# EAGLE design 4channelWormbotShield_fixed_PCBv03_addSSRresist_wThermalRel (EAGLE 9.6.2)
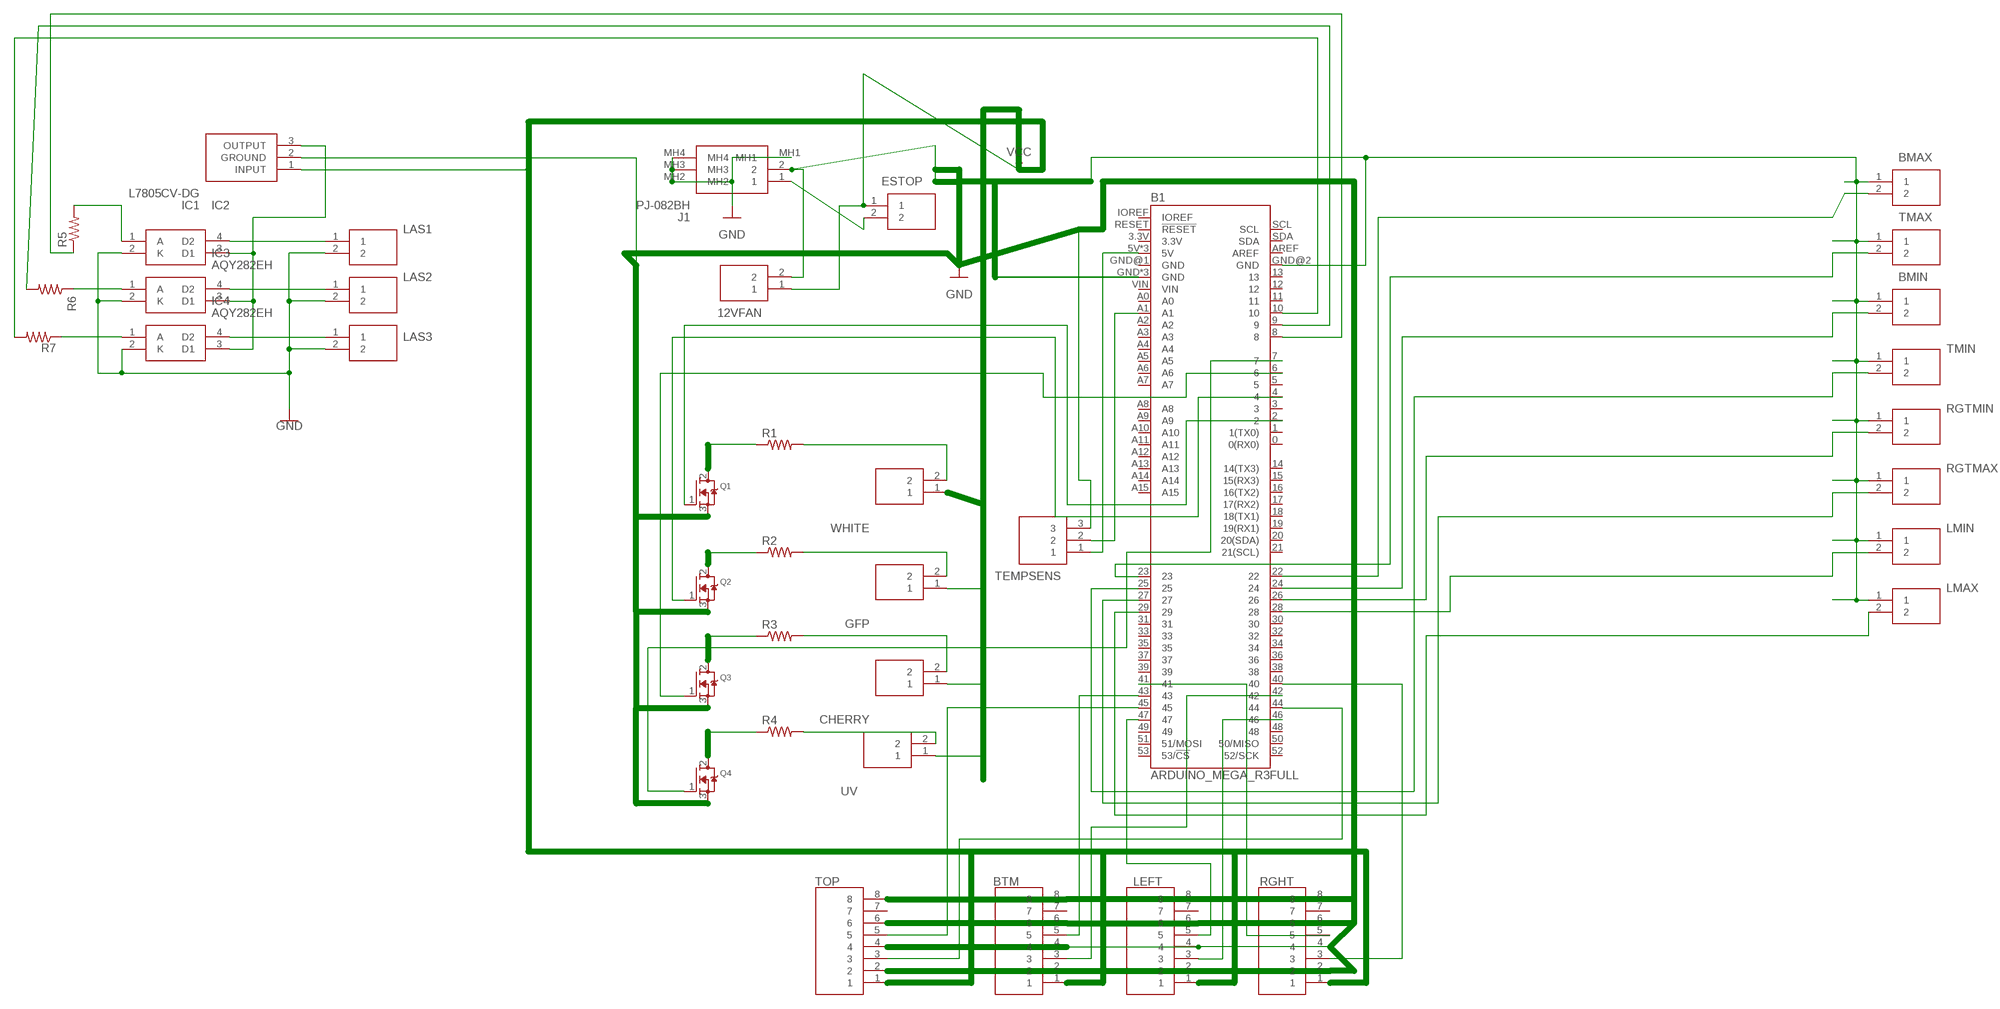
[diagram p0: schematic, sheet 1]

## Parts
12VFAN  1725656  [1725656]
B1  ARDUINO_MEGA_R3FULL  [ARDUINO_MEGA_NO_SILK]
BMAX  1725656  [1725656]
BMIN  1725656  [1725656]
BTM  1725711  [1725711]
CHERRY  1725656  [1725656]
ESTOP  TB003-500-P02BE  [SHDR2W100P0X500_1X2_1000X780X1]
GFP  1725656  [1725656]
IC1  L7805CV-DG  [TO255P460X1020X2008-3P]
IC2  AQY282EH  [DIP762W57P254L478H340Q4N]
IC3  AQY282EH  [DIP762W57P254L478H340Q4N]
IC4  AQY282EH  [DIP762W57P254L478H340Q4N]
J1  PJ-082BH  [PJ082BH]
LAS1  1725656  [1725656]
LAS2  1725656  [1725656]
LAS3  1725656  [1725656]
LEFT  1725711  [1725711]
LMAX  1725656  [1725656]
LMIN  1725656  [1725656]
Q1  MOSFET-NGDS_TO220V  [TO220V]
Q2  MOSFET-NGDS_TO220V  [TO220V]
Q3  MOSFET-NGDS_TO220V  [TO220V]
Q4  MOSFET-NGDS_TO220V  [TO220V]
R1  R-US_0207/10  [0207/10]
R2  R-US_0207/10  [0207/10]
R3  R-US_0207/10  [0207/10]
R4  R-US_0207/10  [0207/10]
R5  R-US_0207/10  [0207/10]
R6  R-US_0207/10  [0207/10]
R7  R-US_0207/10  [0207/10]
RGHT  1725711  [1725711]
RGTMAX  1725656  [1725656]
RGTMIN  1725656  [1725656]
TEMPSENS  1725669  [1725669]
TMAX  1725656  [1725656]
TMIN  1725656  [1725656]
TOP  1725711  [1725711]
UV  1725656  [1725656]
WHITE  1725656  [1725656]

## Nets
GND [power]: 12VFAN.2 B1.GND B1.GND@2(GND) B1.GND@3(GND) B1.GND@4(GND) BMAX.1 BMIN.1 BTM.2 BTM.4 BTM.6 BTM.8 IC1.2(GROUND) IC2.2(K) IC3.2(K) IC4.2(K) J1.2 J1.MH1 J1.MH2 J1.MH3 J1.MH4 LAS1.2 LAS2.2 LAS3.2 LEFT.2 LEFT.4 LEFT.6 LEFT.8 LMAX.1 LMIN.1 Q1.3(S) Q2.3(S) Q3.3(S) Q4.3(S) RGHT.2 RGHT.4 RGHT.6 RGHT.8 RGTMAX.1 RGTMIN.1 TEMPSENS.3 TMAX.1 TMIN.1 TOP.2 TOP.4 TOP.6 TOP.8
N$1: B1.22 BMAX.2
N$2: B1.23 TMAX.2
N$3: B1.24 BMIN.2
N$4 [LEDS]: R1.2 WHITE.2
N$5 [LEDS]: GFP.2 R2.2
N$6 [LEDS]: CHERRY.2 R3.2
N$7: B1.25 TMIN.2
N$8: B1.2 Q1.1(G)
N$9: B1.4 Q2.1(G)
N$10: B1.6 Q3.1(G)
N$11: B1.27 RGTMAX.2
N$12: B1.26 RGTMIN.2
N$13: B1.28 LMIN.2
N$14: B1.29 LMAX.2
N$15: B1.44 TOP.3
N$16: B1.45 TOP.5
N$17: B1.42 BTM.3
N$18: B1.43 BTM.5
N$19: B1.46 LEFT.3
N$20: B1.47 LEFT.5
N$21: B1.40 RGHT.3
N$22: B1.41 RGHT.5
N$23 [LEDS]: R4.2 UV.2
N$24: B1.5V B1.5V@1(5V) B1.5V@2(5V) TEMPSENS.1
N$25: IC2.1(A) R5.2
N$26: B1.A1 TEMPSENS.2
N$27 [power]: ESTOP.2 J1.1
N$28: IC2.4(D2) LAS1.1
N$29: IC3.4(D2) LAS2.1
N$30: B1.8 R5.1
N$31: IC4.4(D2) LAS3.1
N$32: IC1.3(OUTPUT) IC2.3(D1) IC3.3(D1) IC4.3(D1)
N$33: B1.9 R6.2
N$34: B1.10 R7.2
N$35 [LEDS]: Q1.2(D) R1.1
N$36 [LEDS]: Q2.2(D) R2.1
N$37 [LEDS]: Q3.2(D) R3.1
N$38 [LEDS]: Q4.2(D) R4.1
N$39: B1.7 Q4.1(G)
N$40: IC3.1(A) R6.1
N$41: IC4.1(A) R7.1
VCC [power]: 12VFAN.1 BTM.1 CHERRY.1 ESTOP.1 GFP.1 IC1.1(INPUT) LEFT.1 RGHT.1 TOP.1 UV.1 WHITE.1
Unconnected: B1.0(0(RX0)) B1.1(1(TX0)) B1.3 B1.3.3V B1.5 B1.11 B1.12 B1.13 B1.14(14(TX3)) B1.15(15(RX3)) B1.16(16(TX2)) B1.17(17(RX2)) B1.18(18(TX1)) B1.19(19(RX1)) B1.20(20(SDA)) B1.21(21(SCL)) B1.30 B1.31 B1.32 B1.33 B1.34 B1.35 B1.36 B1.37 B1.38 B1.39 B1.48 B1.49 B1.50(50/MISO) B1.51(51/MOSI) B1.52(52/SCK) B1.53(53/!CS) B1.A0 B1.A2 B1.A3 B1.A4 B1.A5 B1.A6 B1.A7 B1.A8 B1.A9 B1.A10 B1.A11 B1.A12 B1.A13 B1.A14 B1.A15 B1.AREF B1.GND@1(GND) B1.IOREF B1.RESET(!RESET) B1.SCL B1.SDA B1.VIN BTM.7 LEFT.7 RGHT.7 TOP.7

## Library data of the parts
12VFAN BMAX BMIN CHERRY GFP LAS1-LAS3 LMAX LMIN RGTMAX RGTMIN TMAX TMIN UV WHITE = SamacSys_Parts:1725656: 2 way PCB vertical mount terminal,2.54mm 2 way PCB vertical mount terminal,2.54mm Source: Datasheet <https://www.phoenixcontact.com/online/portal/gb?uri=pxc-oc-itemdetail:pid=1725656&library=gben&tab=1>; DESCRIPTION: 2 way PCB vertical mount terminal,2.54mm 2 way PCB vertical mount terminal,2.54mm; HEIGHT: 8mm; MANUFACTURER_NAME: Phoenix Contact; MANUFACTURER_PART_NUMBER: 1725656; MOUSER_PART_NUMBER: 651-1725656; MOUSER_PRICE-STOCK: https://www.mouser.co.uk/ProductDetail/Phoenix-Contact/1725656/?qs=Ul7CXFMnlWWQeccayYbRmw%3D%3D
B1 = SparkFun-Boards:ARDUINO_MEGA_R3: Arduino Mega R3 ATmega2560 R3 compatible footprint. SparkFun Products: Arduino Mega 2560 R3 <https://www.sparkfun.com/products/11061>
BTM LEFT RGHT TOP = SamacSys_Parts:1725711: 8 way PCB vertical mount terminal,2.54mm 8 way PCB vertical mount terminal,2.54mm Source: Datasheet; DESCRIPTION: 8 way PCB vertical mount terminal,2.54mm 8 way PCB vertical mount terminal,2.54mm; HEIGHT: mm; MANUFACTURER_NAME: Phoenix Contact; MANUFACTURER_PART_NUMBER: 1725711; MOUSER_PART_NUMBER: 651-1725711; MOUSER_PRICE-STOCK: https://www.mouser.co.uk/ProductDetail/Phoenix-Contact/1725711/?qs=W3wJikR1%252BS7n1cN8b%252BRI%2FQ%3D%3D
ESTOP = SamacSys_Parts:TB003-500-P02BE: Fixed Terminal Blocks screw type, 5.00 , horizontal, 2 poles, CUI Blue, Philip's head screw, PCB mount Source: Datasheet; DESCRIPTION: Fixed Terminal Blocks screw type, 5.00 , horizontal, 2 poles, CUI Blue, Philip's head screw, PCB mount; HEIGHT: 10.3mm; MANUFACTURER_NAME: CUI Inc.; MANUFACTURER_PART_NUMBER: TB003-500-P02BE; MOUSER_PART_NUMBER: 490-TB003-500-P02BE; MOUSER_PRICE-STOCK: https://www.mouser.co.uk/ProductDetail/CUI-Devices/TB003-500-P02BE?qs=vLWxofP3U2yAT9CFQJ%2FCaw%3D%3D
IC1 = SamacSys_Parts:L7805CV-DG: Voltage Regulator 5V 4% 1.5A TO220 L7805CV-DG, Linear Voltage Regulator, Current Limit, Shut-Down 1.5A 5 V, 3-Pin TO220 Source: Datasheet <http://www.st.com/web/en/resource/technical/document/datasheet/CD00000444.pdf>; DESCRIPTION: Voltage Regulator 5V 4% 1.5A TO220 L7805CV-DG, Linear Voltage Regulator, Current Limit, Shut-Down 1.5A 5 V, 3-Pin TO220; HEIGHT: 4.6mm; MANUFACTURER_NAME: STMicroelectronics; MANUFACTURER_PART_NUMBER: L7805CV-DG; MOUSER_PART_NUMBER: 511-L7805CV-DG; MOUSER_PRICE-STOCK: https://www.mouser.co.uk/ProductDetail/STMicroelectronics/L7805CV-DG?qs=T%2FOtf55vL7c3O0as9P9fAw%3D%3D
IC2-IC4 = SamacSys_Parts:AQY282EH: PANASONIC - AQY282EH - SSR, PCB MOSFET, SPST-NO, 500mA, 1.8mA Source: Datasheet <https://media.digikey.com/pdf/Data Sheets/Panasonic Electric Works PDFs/AQW,AQY280,282,284.pdf>; DESCRIPTION: PANASONIC - AQY282EH - SSR, PCB MOSFET, SPST-NO, 500mA, 1.8mA; HEIGHT: 3.4mm; MANUFACTURER_NAME: Panasonic; MANUFACTURER_PART_NUMBER: AQY282EH; MOUSER_PART_NUMBER: 769-AQY282EH; MOUSER_PRICE-STOCK: https://www.mouser.co.uk/ProductDetail/Panasonic-Industrial-Devices/AQY282EH?qs=2rFUEsTwVNyp%2FybG%2FpSbOQ%3D%3D
J1 = SamacSys_Parts:PJ-082BH: DC Power Connectors 2.5mm x 5.5mm horz Source: Datasheet <https://www.mouser.co.uk/datasheet/2/670/pj_082bh-1779031.pdf>; DESCRIPTION: DC Power Connectors 2.5mm x 5.5mm horz; HEIGHT: 10.2mm; MANUFACTURER_NAME: CUI Inc.; MANUFACTURER_PART_NUMBER: PJ-082BH; MOUSER_PART_NUMBER: 490-PJ-082BH; MOUSER_PRICE-STOCK: https://www.mouser.co.uk/ProductDetail/CUI-Devices/PJ-082BH/?qs=WyjlAZoYn52P2Lo8hPB1tg%3D%3D
Q1-Q4 = adafruit:MOSFET-N: N-Channel Mosfet 2N7002E - 60V 260mA SOT23 [Digikey: 2N7002ET1GOSTR-ND] - REEL BSH103 - 30V 850mA SOT23 [Digikey: 568-5013-1-ND]
R1-R7 = adafruit:R-US_: RESISTOR, American symbol
TEMPSENS = SamacSys_Parts:1725669: 3 way PCB vertical mount terminal,2.54mm 3 way PCB vertical mount terminal,2.54mm Source: Datasheet <https://www.phoenixcontact.com/online/portal/gb?uri=pxc-oc-itemdetail:pid=1725669&library=gben&tab=1>; DESCRIPTION: 3 way PCB vertical mount terminal,2.54mm 3 way PCB vertical mount terminal,2.54mm; HEIGHT: 8.5mm; MANUFACTURER_NAME: Phoenix Contact; MANUFACTURER_PART_NUMBER: 1725669; MOUSER_PART_NUMBER: 651-1725669; MOUSER_PRICE-STOCK: https://www.mouser.co.uk/ProductDetail/Phoenix-Contact/1725669?qs=A%2FKWGUWTCZjmkTL0Oe91ew%3D%3D

## Net classes
0 default: width 0.254 mm
1 power: width 1.524 mm
2 LEDS: width 0.432 mm

## Board
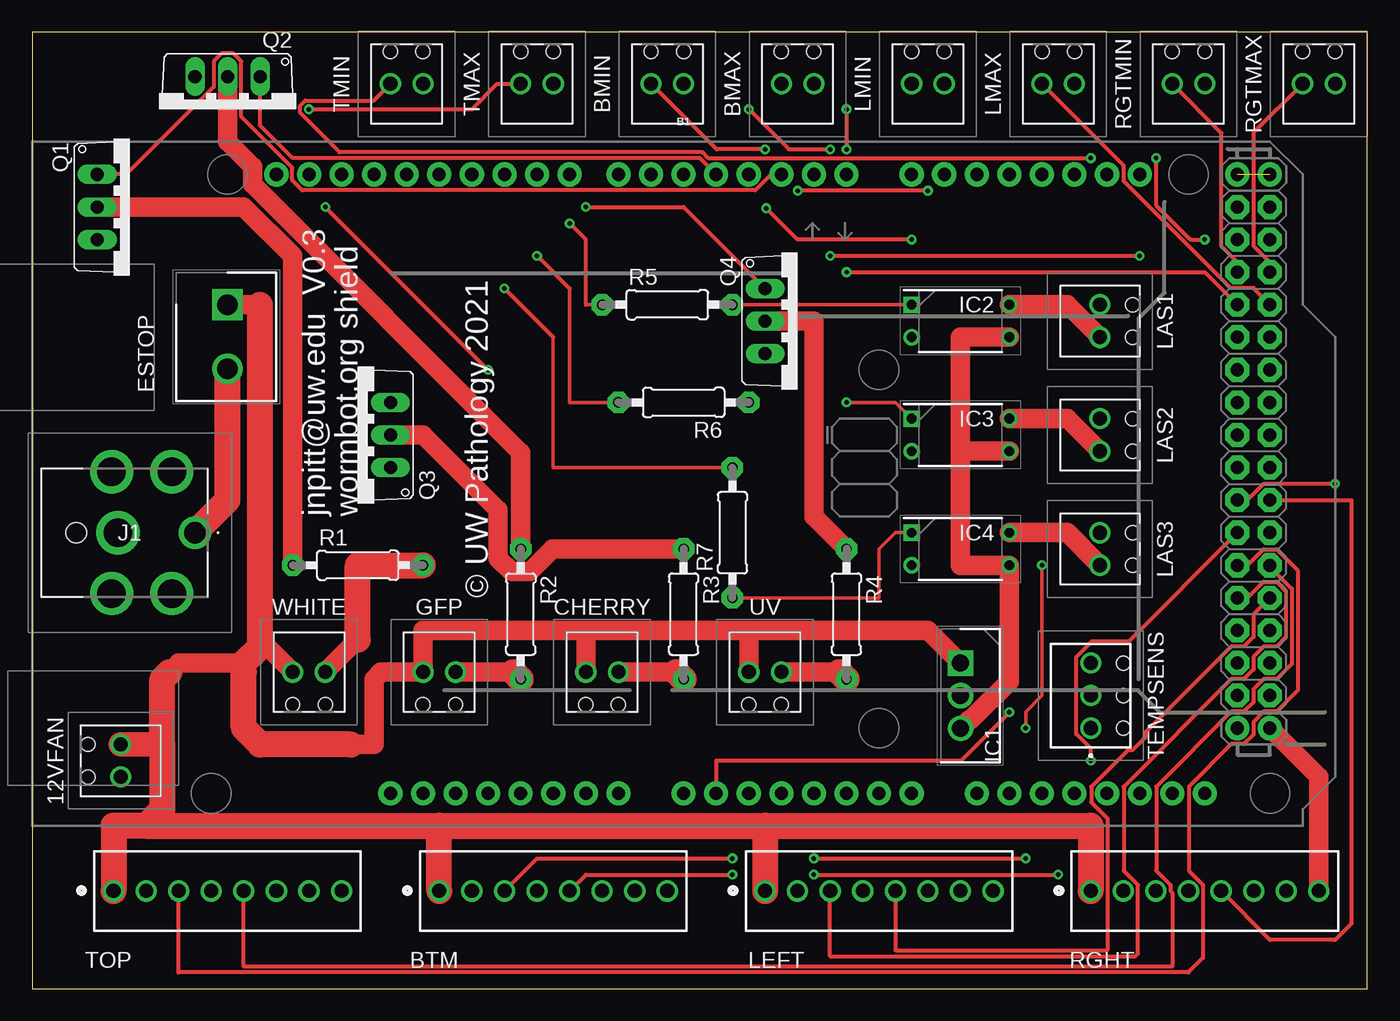
[diagram p1: board, top side]
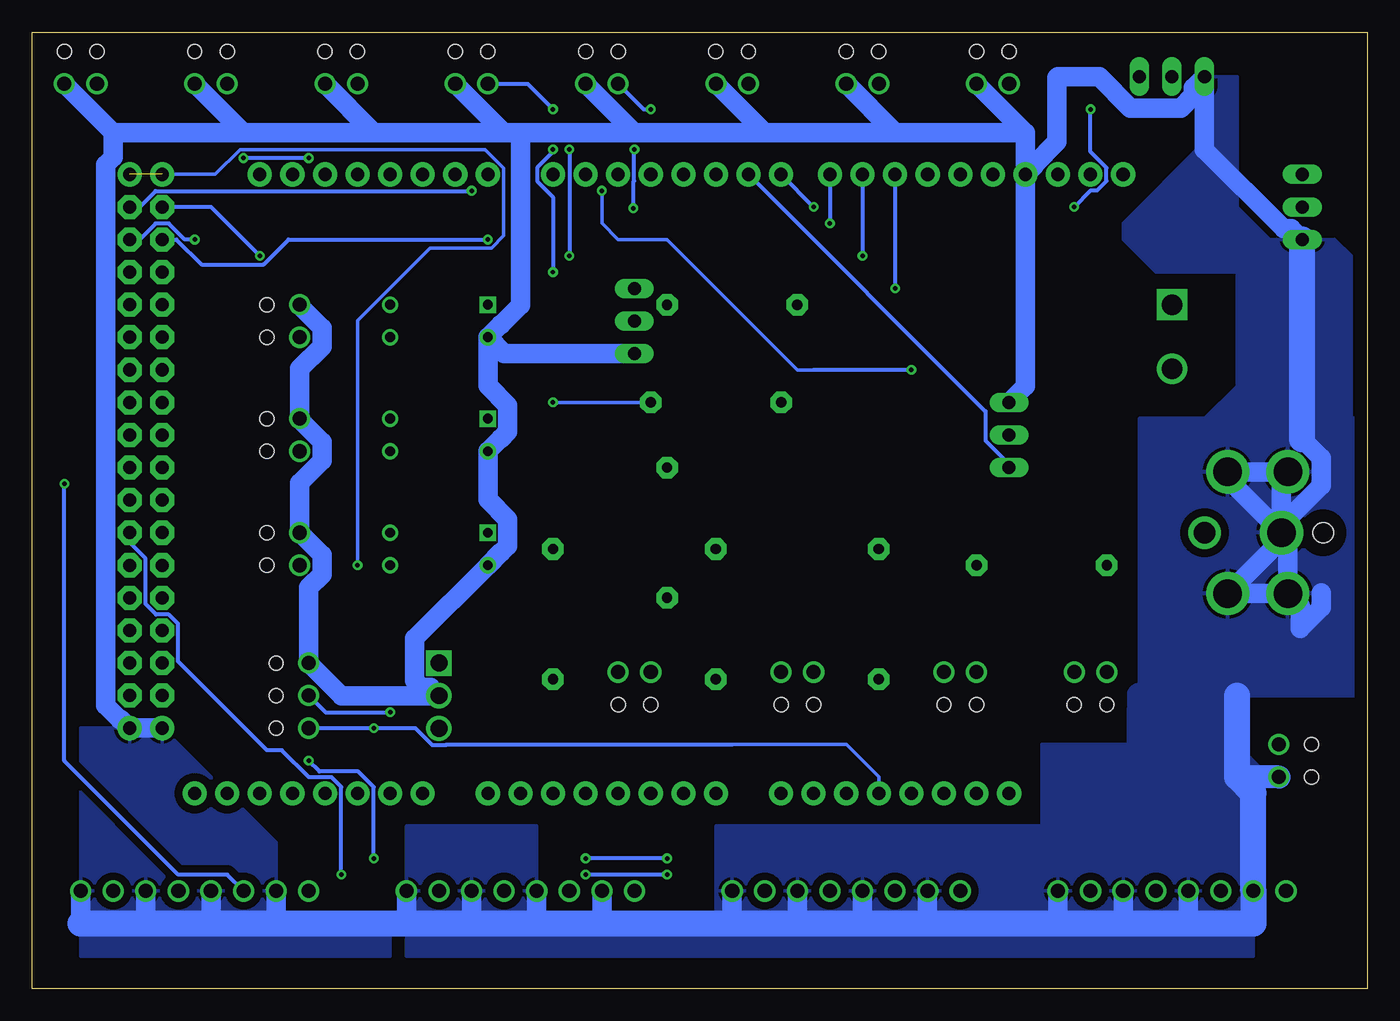
[diagram p2: board, bottom side, seen from below]

Size 104.12 x 74.6 mm. Coordinates in mm from the lower left corner, seen from the top.
Outline: 0,0 104.12,0 104.12,74.6 0,74.6 0,0
Copper layers (1*16): Top 0.035mm / dielectric 1.5mm / Bottom 0.035mm
Design rules "default": minimum track width 6mil, minimum drill 0.35mm, track to track 6mil, track to pad 6mil, pad to pad 6mil, via to via 6mil, smd to smd 6mil, copper to edge 40mil, drill to drill 6mil, minimum pad ring 10mil, minimum via ring 8mil, stop-mask expansion 4mil, vias tented up to drill 0mil, thermal gap 10mil

### Footprints (pad centres in the part's own frame; a part is rotated, then mirrored left to right if it is on the bottom)
1725656 = drill 1.1 pad 1.65: 1 -1.27,3.1; 2 1.27,3.1 | hole 1.1: -1.27,0.56; 1.27,0.56
ARDUINO_MEGA_NO_SILK = drill 1.016 pad 1.88: 0 13.97,24.13; 1 11.43,24.13; 2 8.89,24.13; 3 6.35,24.13; 3.3V -13.97,-24.13; 4 3.81,24.13; 5 1.27,24.13; 5V -11.43,-24.13; 5V@1 44.45,24.13; 5V@2 46.99,24.13; 6 -1.27,24.13; 7 -3.81,24.13; 8 -7.62,24.13; 9 -10.16,24.13; 10 -12.7,24.13; 11 -15.24,24.13; 12 -17.78,24.13; 13 -20.32,24.13; 14 19.05,24.13; 15 21.59,24.13; 16 24.13,24.13; 17 26.67,24.13; 18 29.21,24.13; 19 31.75,24.13; 20 34.29,24.13; 21 36.83,24.13; A0 1.27,-24.13; A1 3.81,-24.13; A2 6.35,-24.13; A3 8.89,-24.13; A4 11.43,-24.13; A5 13.97,-24.13; A6 16.51,-24.13; A7 19.05,-24.13; A8 24.13,-24.13; A9 26.67,-24.13; A10 29.21,-24.13; A11 31.75,-24.13; A12 34.29,-24.13; A13 36.83,-24.13; A14 39.37,-24.13; A15 41.91,-24.13; AREF -25.4,24.13; GND -8.89,-24.13; GND@1 -6.35,-24.13; GND@2 44.45,-19.05; GND@3 46.99,-19.05; GND@4 -22.86,24.13; IOREF -19.05,-24.13; NC -21.59,-24.13; RESET -16.51,-24.13; SCL -30.48,24.13; SDA -27.94,24.13; VIN -3.81,-24.13 | drill 1.016 pad 1.88 octagon: 22 44.45,21.59; 23 46.99,21.59; 24 44.45,19.05; 25 46.99,19.05; 26 44.45,16.51; 27 46.99,16.51; 28 44.45,13.97; 29 46.99,13.97; 30 44.45,11.43; 31 46.99,11.43; 32 44.45,8.89; 33 46.99,8.89; 34 44.45,6.35; 35 46.99,6.35; 36 44.45,3.81; 37 46.99,3.81; 38 44.45,1.27; 39 46.99,1.27; 40 44.45,-1.27; 41 46.99,-1.27; 42 44.45,-3.81; 43 46.99,-3.81; 44 44.45,-6.35; 45 46.99,-6.35; 46 44.45,-8.89; 47 46.99,-8.89; 48 44.45,-11.43; 49 46.99,-11.43; 50 44.45,-13.97; 51 46.99,-13.97; 52 44.45,-16.51; 53 46.99,-16.51
1725711 = drill 1.1 pad 1.65: 1 -8.89,0; 2 -6.35,0; 3 -3.81,0; 4 -1.27,0; 5 1.27,0; 6 3.81,0; 7 6.35,0; 8 8.89,0
SHDR2W100P0X500_1X2_1000X780X1 = drill 1.6 pad 2.4 square: 1 0,0 | drill 1.6 pad 2.4: 2 5,0
TO255P460X1020X2008-3P = drill 1.32 pad 1.98 square: 1 0,0 | drill 1.32 pad 1.98: 2 2.55,0; 3 5.1,0
DIP762W57P254L478H340Q4N = drill 0.77 pad 1.17 square: 1 -3.81,1.27 | drill 0.77 pad 1.17: 2 -3.81,-1.27; 3 3.81,-1.27; 4 3.81,1.27
PJ082BH = drill 1.7 pad 2.55: 1 0,0 | drill 2.193 pad 3.42: 2 -6,0 | drill 2.24 pad 3.36: MH1 -1.8,4.75; MH2 -6.5,4.75; MH3 -1.8,-4.75; MH4 -6.5,-4.75 | hole 1.6: -9.25,0
TO220V = drill 1.016 long: 1 -2.54,-2.54; 2 0,-2.54; 3 2.54,-2.54
0207/10 = drill 0.813 pad 1.676 octagon: 1 -5.08,0; 2 5.08,0
1725669 = drill 1.1 pad 1.65: 1 0,0; 2 2.54,0; 3 5.08,0 | hole 1.1: 0,-2.54; 2.54,-2.54; 5.08,-2.54

### Placement (x,y rotation side)
12VFAN  3.81,17.78 270 top
B1  49.53,39.37 0 top
BMAX  59.69,73.66 180 top
BMIN  49.53,73.66 180 top
BTM  40.64,7.62 0 top
CHERRY  44.45,21.59 0 top
ESTOP  15.24,53.34 270 top
GFP  31.75,21.59 0 top
IC1  72.39,25.4 270 top
IC2  72.39,52.07 0 top
IC3  72.39,43.18 0 top
IC4  72.39,34.29 0 top
J1  12.7,35.56 0 top
LAS1  86.36,52.07 90 top
LAS2  86.36,43.18 90 top
LAS3  86.36,34.29 90 top
LEFT  66.04,7.62 0 top
LMAX  80.01,73.66 180 top
LMIN  69.85,73.66 180 top
Q1  7.62,60.96 270 top
Q2  15.24,68.58 180 top
Q3  25.4,43.18 90 top
Q4  59.69,52.07 270 top
R1  25.4,33.02 0 top
R2  38.1,29.21 270 top
R3  50.8,29.21 270 top
R4  63.5,29.21 270 top
R5  49.53,53.34 0 top
R6  50.8,45.72 180 top
R7  54.61,35.56 90 top
RGHT  91.44,7.62 0 top
RGTMAX  100.33,73.66 180 top
RGTMIN  90.17,73.66 180 top
TEMPSENS  82.55,20.32 90 top
TMAX  39.37,73.66 180 top
TMIN  29.21,73.66 180 top
TOP  15.24,7.62 0 top
UV  57.15,21.59 0 top
WHITE  21.59,21.59 0 top

### Tracks (layer width: path | path; a pad name or v marks a point on that pad's centre or on a via)
GND
  Top 1.524: B1.GND@3 100.33,16.51 RGHT.8
  Bottom 1.524: 5.08,42.86 3.61,41.38 3.61,39.23 6.7,36.14 J1.2 | Q1.3 5.94,59.28 6.54,59.28 12.7,65.45 Q2.3 13.56,70.26 13.56,69.66 14.55,68.68 18.47,68.68 20.91,71.12 24.13,71.12 24.21,71.04 24.21,66.04 25.98,64.27 25.98,64.19 B1.GND@4 | B1.GND@4 26.67,46.99 Q3.3 | TMIN.1 26.67,66.75 | 26.67,66.75 B1.GND@4 | TMAX.1 36.83,66.75 | 36.83,66.75 26.67,66.75 | BMIN.1 46.99,66.75 | 46.99,66.75 36.83,66.75 | BMAX.1 57.15,66.75 | 57.15,66.75 46.99,66.75 | LMIN.1 67.31,66.75 | 67.31,66.75 66.04,66.75 | 66.04,66.75 57.15,66.75 | LMAX.1 77.47,66.75 | 77.47,66.75 67.31,66.75 | RGTMIN.1 87.63,66.75 | 87.63,66.75 77.47,66.75 | RGTMAX.1 97.79,66.75 | 97.79,66.75 87.63,66.75 | 97.79,66.75 97.79,64.85 98.37,64.27 98.37,22.09 97.29,21.01 97.21,21.01 B1.GND@3 B1.GND@2 | 3.61,30.86 3.61,29.73 5.24,28.1 5.24,29.85 J1.MH4 | 11.43,5.08 13.97,5.08 | 13.97,5.08 TOP.4 | 13.97,5.08 19.05,5.08 | 19.05,5.08 TOP.6 | 19.05,5.08 24.13,5.08 | 24.13,5.08 TOP.8 | 24.13,5.08 34.29,5.08 | 34.29,5.08 BTM.2 | 34.29,5.08 39.37,5.08 | 39.37,5.08 BTM.4 | BTM.6 44.45,5.08 | 39.37,5.08 44.45,5.08 | 44.45,5.08 49.53,5.08 | 49.53,5.08 BTM.8 | 49.53,5.08 59.69,5.08 | 59.69,5.08 LEFT.2 | 59.69,5.08 64.77,5.08 | 64.77,5.08 LEFT.4 | 64.77,5.08 69.85,5.08 | 69.85,5.08 LEFT.6 | 69.85,5.08 74.93,5.08 | 74.93,5.08 LEFT.8 | 74.93,5.08 85.09,5.08 | 85.09,5.08 RGHT.2 | 85.09,5.08 90.17,5.08 | 90.17,5.08 RGHT.4 | 90.17,5.08 95.25,5.08 | 95.25,5.08 RGHT.6 | 95.25,5.08 100.33,5.08 RGHT.8 | Q4.3 67.31,49.53 IC2.2 | IC2.2 68.58,47.02 67.03,45.47 67.03,43.43 67.56,42.9 67.59,42.9 IC3.2 68.58,38.13 67.03,36.58 67.03,34.54 67.56,34.01 67.59,34.01 IC4.2 74.29,27.31 74.29,24.03 73.76,23.5 73.04,23.5 IC1.2 80,22.85 TEMPSENS.3 82.55,31.27 81.52,32.3 81.52,33.82 LAS3.2 83.26,39.45 81.52,41.19 81.52,42.63 83.26,44.37 LAS2.2 83.26,48.34 81.52,50.08 81.52,51.52 83.26,53.26 LAS1.2
  Bottom 1.524: IC2.2 67.59,51.79 67.56,51.79 66.04,53.31 66.04,66.75 | J1.MH4 6.2,35.06 J1.2 | J1.2 6.7,39.81 J1.MH2 J1.MH1 10.9,39.76 J1.2 | J1.MH4 J1.MH3 6.7,35.01 J1.2
  Bottom 1.778: 12VFAN.2 10.16,16.51
  Bottom 2.032: 5.08,42.86 Q1.3 | 10.16,22.86 10.16,16.51 8.89,15.24 TOP.2 8.89,5.08 100.33,5.08
  pour Bottom (isolate 0.61): 0,44.45 17.78,44.45 17.78,22.86 0,22.86
  pour Bottom (isolate 0.61): 1.27,44.45 1.27,57.15 2.54,58.42 7.62,58.42 10.16,60.96 10.16,71.12 12.7,71.12 12.7,66.04 19.05,59.69 19.05,58.42 17.78,57.15 16.51,55.88 10.16,55.88 10.16,46.99 12.7,44.45
  pour Bottom (isolate 0.61): 17.78,22.86 17.78,19.05 8.89,10.16 8.89,16.51 10.16,17.78 10.16,22.86
  pour Bottom (isolate 0.61): 25.4,5.08 25.4,19.05 17.78,19.05 8.89,10.16 8.89,5.08
  pour Bottom (isolate 0.61): 25.4,12.7 50.8,12.7 50.8,2.54 8.89,2.54 8.89,12.7
  pour Bottom (isolate 0.61): 64.77,2.54 64.77,12.7 74.93,12.7 74.93,2.54
  pour Bottom (isolate 0.61): 76.2,2.54 100.33,2.54 100.33,20.32 93.98,20.32 85.09,11.43 85.09,5.08 76.2,5.08
  pour Bottom (isolate 0.61): 50.8,2.54 64.77,2.54 64.77,5.08 50.8,5.08
N$1  (via drill 0.35)
  Top 0.305: v55.88,68.58 59.01,65.45 v62.23,65.45 | v62.23,57.15 v86.36,57.15
  Bottom 0.305: BMAX.2 56.44,68.58 v55.88,68.58 | v62.23,65.45 v62.23,57.15 | v86.36,57.15 90.17,60.96 B1.22
N$2  (via drill 0.35)
  Top 0.305: v69.85,62.23 v59.69,62.23 | v35.56,48.26 v22.86,60.96 | v21.59,68.58 34.29,68.58 36.27,70.56 TMAX.2
  Bottom 0.254: 43.18,48.26 44.45,48.26 54.61,58.42 58.42,58.42 59.69,59.69 v59.69,62.23
  Bottom 0.305: B1.23 95.74,60.96 94.5,62.2 69.88,62.2 v69.85,62.23 | v35.56,48.26 43.18,48.26 | v21.59,68.58 21.59,65.26 20.34,64.02 20.34,62.98 21.07,62.26 21.57,62.26 v22.86,60.96
N$3  (via drill 0.35)
  Top 0.305: v68.58,58.42 59.69,58.42 v57.24,60.87 | v57.15,65.45 53.37,65.45 BMIN.2
  Bottom 0.305: B1.24 92.87,58.42 90.91,56.47 86.08,56.47 84.12,58.42 v68.58,58.42 | v57.24,60.87 57.24,62.92 57.17,62.98 57.17,65.43 v57.15,65.45
N$4
  Top 1.524: WHITE.2 25.4,27.23
  Top 2.032: 25.4,27.23 25.4,33.02 R1.2
N$5
  Top 1.524: GFP.2 37.54,24.69
  Top 2.032: 37.54,24.69 R2.2
N$6
  Top 1.524: CHERRY.2 50.24,24.69
  Top 2.032: 50.24,24.69 R3.2
N$7  (via drill 0.35)
  Top 0.305: v82.55,64.77 52.72,64.77 52.26,65.23 23.98,65.23 20.91,68.3 20.91,68.86 21.31,69.26 26.64,69.26 TMIN.2 | v87.63,64.77 87.63,61.12 90.33,58.42 v91.44,58.42
  Bottom 0.305: v82.55,64.77 v87.63,64.77 | v91.44,58.42 92.22,58.42 93.46,59.66 94.5,59.66 95.74,58.42 B1.25
N$8
  Top 0.305: B1.2 57.64,63.5 56.4,62.26 21.07,62.26 20.3,63.03 20.3,64.02 16.31,68 16.31,72.32 15.68,72.95 14.8,72.95 14.17,72.32 14.17,70.32 7.35,63.5 Q1.1
N$9
  Top 0.305: B1.4 52.07,64.77 20.32,64.77 17.78,67.31 Q2.1
N$10
  Bottom 0.305: B1.6 29.77,45.01 29.77,42.74 27.94,40.91 Q3.1
N$11
  Top 0.305: B1.27 96.52,56.66 95.28,57.9 95.28,66.78 RGTMAX.2
N$12
  Top 0.305: B1.26 93.98,56.66 92.73,57.9 92.73,66.72 RGTMIN.2
N$13  (via drill 0.35)
  Top 0.305: v63.5,68.58 v63.5,65.45 | v63.5,55.88 91.44,55.88 B1.28
  Bottom 0.305: LMIN.2 65.48,70.56 v63.5,68.58 | v63.5,65.45 63.5,65.26 64.75,64.02 64.75,62.98 63.5,61.74 v63.5,55.88
N$14
  Top 0.305: B1.29 95.22,54.63 93.46,54.63 85.11,62.98 85.11,64.19 LMAX.2
N$15
  Top 0.305: B1.44 94.76,33.02 96,34.27 97.04,34.27 98.68,32.62 98.68,23.26 97.04,21.61 96.06,21.61 95.22,20.79 95.22,19.8 94.5,19.07 93.52,19.07 90.19,15.76 90.19,9.19 91.3,8.09 91.3,2.4 90.17,1.27 11.43,1.27 TOP.3
N$16
  Top 0.305: B1.45 96.52,32.89 98.22,31.18 98.22,25.34 97.04,24.16 96.06,24.16 95.22,23.32 95.22,22.34 94.5,21.61 93.52,21.61 87.66,15.76 87.66,9.19 88.76,8.09 88.76,7.62 88.9,7.48 88.9,1.73 16.51,1.73 TOP.5
N$17  (via drill 0.35)
  Top 0.305: BTM.3 39.37,10.16 v54.61,10.16 | v60.96,10.16 v77.47,10.16 | B1.42 85.54,27.12 82.67,27.12 81.42,25.87 81.42,19.85 82.55,18.72 v82.55,17.78
  Bottom 0.305: v54.61,10.16 v60.96,10.16 | v82.55,17.78 81.71,16.94 78.68,16.94 77.47,15.73 v77.47,10.16
N$18  (via drill 0.35)
  Top 0.305: BTM.5 43.18,8.89 v54.61,8.89 | v60.96,8.89 v80.01,8.89
  Bottom 0.305: v54.61,8.89 v60.96,8.89 | v80.01,8.89 80.01,15.73 80.76,16.48 82.53,16.48 84.64,18.6 85.8,18.6 92.73,25.54 92.73,28.46 93.46,29.18 94.44,29.18 95.28,30.02 95.28,33.54 96.52,34.78 B1.43
N$19
  Top 0.305: B1.46 94.76,30.48 96,31.73 97.04,31.73 97.77,31 97.77,27.42 97.04,26.7 96.06,26.7 95.22,25.86 95.22,24.88 94.5,24.16 93.52,24.16 85.11,15.76 85.11,9.19 86.22,8.09 86.22,2.75 86,2.54 62.23,2.54 LEFT.3
N$20
  Top 0.305: B1.47 95.22,29.18 95.22,27.42 94.5,26.7 93.52,26.7 86.81,19.99 86.81,19.61 85.8,18.6 85.42,18.6 82.58,15.76 82.58,14.54 83.87,13.25 83.87,3.05 83.82,3 67.31,3 LEFT.5
N$21  (via drill 0.35)
  Top 0.305: B1.40 94.76,38.1 96,39.34 101.58,39.34 v101.6,39.37
  Bottom 0.305: RGHT.3 88.9,8.89 92.71,8.89 101.6,17.78 v101.6,39.37
N$22
  Top 0.305: B1.41 102.87,38.1 102.87,5.08 101.6,3.81 96.52,3.81 RGHT.5
N$23
  Top 1.524: UV.2 62.94,24.69
  Top 2.032: 62.94,24.69 R4.2
N$24  (via drill 0.35)  (1 unrouted)
  Top 0.254: v77.47,20.32 77.47,21.59 78.74,22.86 v78.74,33.02
  Bottom 0.254: 49.53,19.05 40.64,19.05 38.1,16.51 B1.5V | B1.5V@1 89.83,63.5 87.9,65.43 68.78,65.43 67.36,64 67.36,58.71 68.31,57.76 73.08,57.76 78.74,52.1 v78.74,33.02
  Bottom 0.305: 49.53,19.05 71.81,19.05 71.85,19 72.93,19 74.24,20.32 v77.47,20.32 TEMPSENS.1
N$25
  Top 0.254: R5.2 IC2.1
N$26  (via drill 0.35)
  Top 0.305: v76.2,21.56 72.42,17.78 53.34,17.78 B1.A1
  Bottom 0.305: TEMPSENS.2 81.25,21.56 v76.2,21.56
N$27
  Top 2.032: J1.1 15.24,38.1 ESTOP.2
N$28
  Top 1.524: IC2.4 80.72,53.34 LAS1.1
N$29
  Top 1.524: IC3.4 80.72,44.45 LAS2.1
N$30  (via drill 0.35)
  Top 0.254: R5.1 43.18,53.34
  Top 0.305: v41.91,59.69 43.18,58.42 43.18,53.34
  Bottom 0.305: B1.8 v41.91,59.69
N$31
  Top 1.524: IC4.4 80.72,35.56 LAS3.1
N$32
  Top 1.524: IC1.3 73.04,20.95 73.18,20.95 76.2,23.97 IC4.3 72.39,33.02 72.39,41.91 | 72.39,41.91 IC3.3 | IC2.3 72.39,50.8 72.39,41.91
N$33  (via drill 0.35)
  Top 0.254: 41.91,54.61 41.91,45.72 R6.2
  Top 0.305: v39.37,57.15 41.91,54.61
  Bottom 0.305: B1.9 v39.37,57.15
N$34  (via drill 0.35)
  Top 0.254: 40.64,50.8 40.64,40.64 R7.2
  Top 0.305: v36.83,54.61 40.64,50.8
  Bottom 0.305: B1.10 v36.83,54.61
N$35
  Top 1.524: R1.1 20.32,57.15 16.51,60.96 Q1.2
N$36
  Top 1.524: R2.1 38.1,41.83 17.2,62.73 17.2,64.08 15.24,66.04 Q2.2
N$37
  Top 1.524: R3.1 40.58,34.29 38.83,32.54 37.37,32.54 36.35,33.56 36.35,37.31 30.48,43.18 Q3.2
N$38
  Top 1.524: R4.1 60.96,36.83 60.96,52.07 Q4.2
N$39  (via drill 0.35)
  Top 0.305: v43.18,60.96 50.8,60.96 Q4.1
  Bottom 0.305: B1.7 v43.18,60.96
N$40  (via drill 0.35)
  Top 0.254: v63.5,45.72 67.31,45.72 IC3.1
  Bottom 0.254: R6.1 v63.5,45.72
N$41
  Top 0.254: R7.1 66.04,30.48 66.04,34.29 67.31,35.56 IC4.1
VCC
  Top 1.524: 17.78,53.34 ESTOP.1 | WHITE.1 17.78,27.23 17.78,26.67 | 16.51,24.69 16.51,25.4 11.43,25.4 10.16,24.13 | 43.18,27.94 30.48,27.94 GFP.1 27.23,24.69 26.67,24.13 26.67,19.05 24.84,19.05 | 43.18,27.94 CHERRY.1 | 43.18,27.94 55.88,27.94 | 55.88,27.94 UV.1 | IC1.1 69.85,27.94 55.88,27.94
  Top 1.905: 12VFAN.1 10.16,19.05
  Top 2.032: 17.78,27.23 17.78,53.34 | 24.84,19.05 17.78,19.05 16.51,20.32 16.51,24.69 | 16.51,25.4 17.78,26.67 | 8.89,12.7 10.16,13.97 10.16,19.05 10.16,24.13 10.72,24.69 | 8.89,12.7 6.35,12.7 TOP.1 | 8.89,12.7 31.75,12.7 | BTM.1 31.75,12.7 | 31.75,12.7 57.15,12.7 | 57.15,12.7 LEFT.1 | 57.15,12.7 82.55,12.7 RGHT.1

### Text on the board
tPlace: jnpitt@uw.edu V0.3 | wormbot.org shield | © UW Pathology 2021